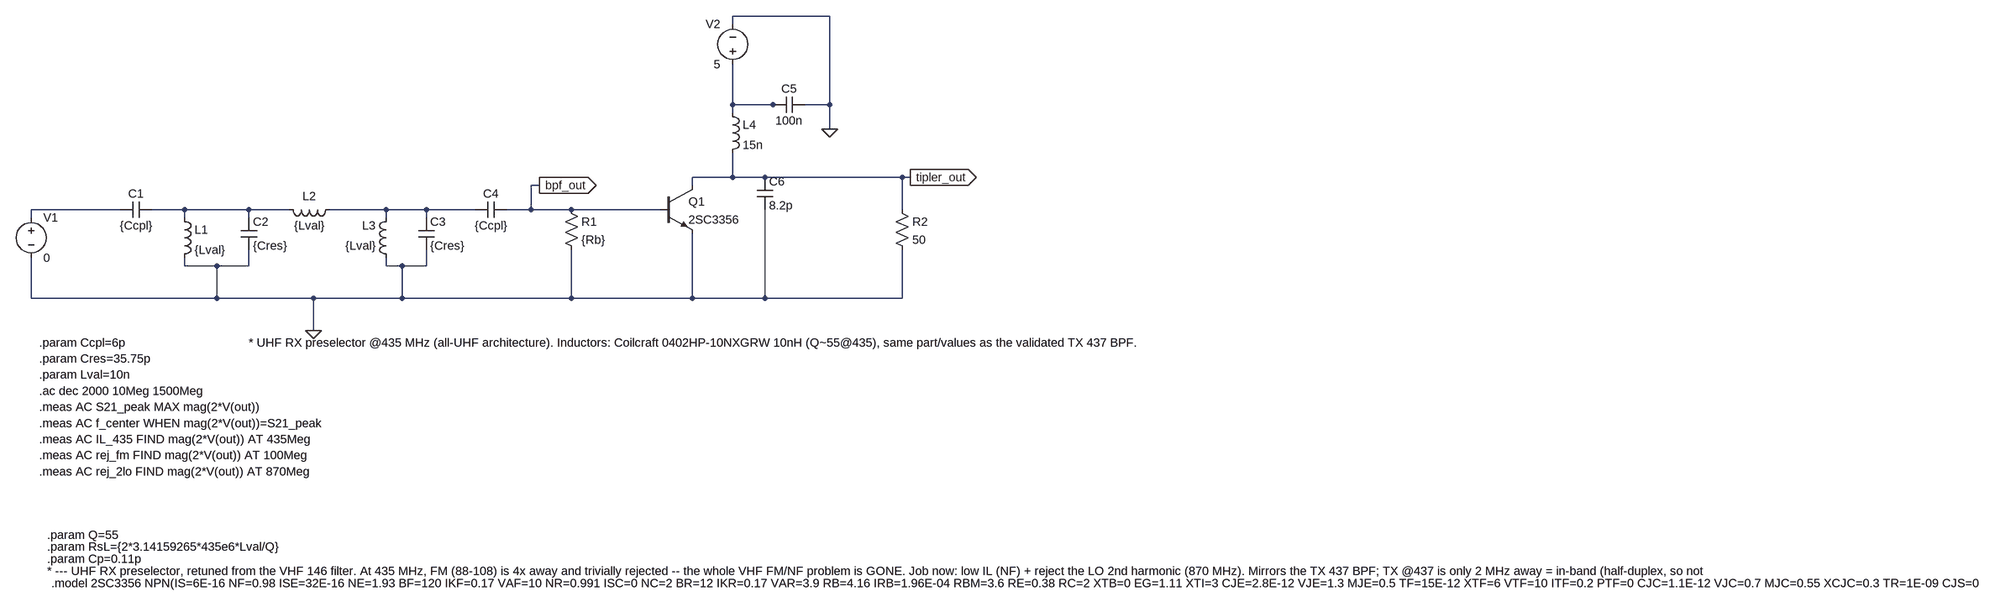
[diagram p0: schematic rx_circuit.asc]
rx_circuit.asc, the LTspice schematic file:
Version 4.1
SHEET 1 4300 1040
WIRE 1472 -256 1280 -256
WIRE 1280 -240 1280 -256
WIRE 1280 -80 1280 -160
WIRE 1360 -80 1280 -80
WIRE 1376 -80 1360 -80
WIRE 1472 -80 1472 -256
WIRE 1472 -80 1424 -80
WIRE 1280 -64 1280 -80
WIRE 1472 -32 1472 -80
WIRE 1280 64 1280 16
WIRE 1280 64 1200 64
WIRE 1344 64 1280 64
WIRE 1616 64 1344 64
WIRE 1632 64 1616 64
WIRE 896 80 880 80
WIRE 1200 80 1200 64
WIRE 64 128 -112 128
WIRE 192 128 128 128
WIRE 320 128 192 128
WIRE 400 128 320 128
WIRE 592 128 480 128
WIRE 672 128 592 128
WIRE 768 128 672 128
WIRE 880 128 880 80
WIRE 880 128 832 128
WIRE 960 128 880 128
WIRE 1136 128 960 128
WIRE 1616 128 1616 64
WIRE -112 144 -112 128
WIRE 192 144 192 128
WIRE 320 144 320 128
WIRE 592 144 592 128
WIRE 672 144 672 128
WIRE 192 240 192 224
WIRE 256 240 192 240
WIRE 320 240 320 208
WIRE 320 240 256 240
WIRE 592 240 592 224
WIRE 624 240 592 240
WIRE 672 240 672 208
WIRE 672 240 624 240
WIRE -112 304 -112 224
WIRE 256 304 256 240
WIRE 256 304 -112 304
WIRE 448 304 256 304
WIRE 624 304 624 240
WIRE 624 304 448 304
WIRE 960 304 960 208
WIRE 960 304 624 304
WIRE 1200 304 1200 176
WIRE 1200 304 960 304
WIRE 1344 304 1344 128
WIRE 1344 304 1200 304
WIRE 1616 304 1616 208
WIRE 1616 304 1344 304
WIRE 448 368 448 304
FLAG 448 368 0
FLAG 1472 -32 0
FLAG 896 80 bpf_out
IOPIN 896 80 Out
FLAG 1632 64 tipler_out
IOPIN 1632 64 Out
SYMBOL cap 128 112 R90
WINDOW 0 0 32 VBottom 2
WINDOW 3 32 32 VTop 2
SYMATTR InstName C1
SYMATTR Value {Ccpl}
SYMBOL ind 176 128 R0
SYMATTR InstName L1
SYMATTR Value {Lval}
SYMATTR SpiceLine Rser={RsL} Cpar={Cp}
SYMBOL cap 304 144 R0
SYMATTR InstName C2
SYMATTR Value {Cres}
SYMBOL ind 496 112 R90
WINDOW 0 5 56 VBottom 2
WINDOW 3 32 56 VTop 2
SYMATTR InstName L2
SYMATTR Value {Lval}
SYMATTR SpiceLine Rser={RsL} Cpar={Cp}
SYMBOL ind 608 240 R180
WINDOW 0 36 80 Left 2
WINDOW 3 36 40 Left 2
SYMATTR InstName L3
SYMATTR Value {Lval}
SYMATTR SpiceLine Rser={RsL} Cpar={Cp}
SYMBOL cap 656 144 R0
SYMATTR InstName C3
SYMATTR Value {Cres}
SYMBOL cap 832 112 R90
WINDOW 0 0 32 VBottom 2
WINDOW 3 32 32 VTop 2
SYMATTR InstName C4
SYMATTR Value {Ccpl}
SYMBOL res 944 112 R0
SYMATTR InstName R1
SYMATTR Value {Rb}
SYMBOL voltage -112 128 R0
SYMATTR InstName V1
SYMATTR Value 0
SYMATTR Value2 AC 1
SYMATTR SpiceLine Rser=50
SYMBOL npn 1136 80 R0
SYMATTR InstName Q1
SYMATTR Value 2SC3356
SYMBOL ind 1264 -80 R0
SYMATTR InstName L4
SYMATTR Value 15n
SYMATTR SpiceLine Rser=1m
SYMBOL cap 1424 -96 R90
WINDOW 0 0 32 VBottom 2
WINDOW 3 32 32 VTop 2
SYMATTR InstName C5
SYMATTR Value 100n
SYMBOL voltage 1280 -144 R180
WINDOW 0 24 96 Left 2
WINDOW 3 24 16 Left 2
WINDOW 123 0 0 Left 0
WINDOW 39 0 0 Left 0
SYMATTR InstName V2
SYMATTR Value 5
SYMBOL cap 1328 64 R0
SYMATTR InstName C6
SYMATTR Value 8.2p
SYMBOL res 1600 112 R0
SYMATTR InstName R2
SYMATTR Value 50
TEXT -96 392 Left 2 !.param Ccpl=6p
TEXT -96 424 Left 2 !.param Cres=35.75p
TEXT -96 456 Left 2 !.param Lval=10n
TEXT 320 392 Left 2 !* UHF RX preselector @435 MHz (all-UHF architecture). Inductors: Coilcraft 0402HP-10NXGRW 10nH (Q~55@435), same part/values as the validated TX 437 BPF.
TEXT -80 792 Left 2 !.param Q=55
TEXT -80 816 Left 2 !.param RsL={2*3.14159265*435e6*Lval/Q}
TEXT -80 840 Left 2 !.param Cp=0.11p
TEXT -80 864 Left 2 !* --- UHF RX preselector, retuned from the VHF 146 filter. At 435 MHz, FM (88-108) is 4x away and trivially rejected -- the whole VHF FM/NF problem is GONE. Job now: low IL (NF) + reject the LO 2nd harmonic (870 MHz). Mirrors the TX 437 BPF; TX @437 is only 2 MHz away = in-band (half-duplex, so not rejected here). ---
TEXT -96 488 Left 2 !.ac dec 2000 10Meg 1500Meg
TEXT -96 520 Left 2 !.meas AC S21_peak MAX mag(2*V(out))
TEXT -96 552 Left 2 !.meas AC f_center WHEN mag(2*V(out))=S21_peak
TEXT -96 584 Left 2 !.meas AC IL_435 FIND mag(2*V(out)) AT 435Meg
TEXT -96 616 Left 2 !.meas AC rej_fm FIND mag(2*V(out)) AT 100Meg
TEXT -96 648 Left 2 !.meas AC rej_2lo FIND mag(2*V(out)) AT 870Meg
TEXT -72 888 Left 2 !.model 2SC3356 NPN(IS=6E-16 NF=0.98 ISE=32E-16 NE=1.93 BF=120 IKF=0.17 VAF=10 NR=0.991 ISC=0 NC=2 BR=12 IKR=0.17 VAR=3.9 RB=4.16 IRB=1.96E-04 RBM=3.6 RE=0.38 RC=2 XTB=0 EG=1.11 XTI=3 CJE=2.8E-12 VJE=1.3 MJE=0.5 TF=15E-12 XTF=6 VTF=10 ITF=0.2 PTF=0 CJC=1.1E-12 VJC=0.7 MJC=0.55 XCJC=0.3 TR=1E-09 CJS=0 VJS=0.75 MJS=0 FC=0.5)

The netlist it stands for:
* rx_circuit.asc
C1 N003 N002 {Ccpl}
L1 N003 0 {Lval} Rser={RsL} Cpar={Cp}
C2 N003 0 {Cres}
L2 N004 N003 {Lval} Rser={RsL} Cpar={Cp}
L3 0 N004 {Lval} Rser={RsL} Cpar={Cp}
C3 N004 0 {Cres}
C4 bpf_out N004 {Ccpl}
R1 bpf_out 0 {Rb}
V1 N002 0 0 AC 1 Rser=50
Q1 tipler_out bpf_out 0 0 2SC3356
L4 N001 tipler_out 15n Rser=1m
C5 0 N001 100n
V2 N001 0 5
C6 tipler_out 0 8.2p
R2 tipler_out 0 50
.model NPN NPN
.model PNP PNP
.lib standard.bjt
.param Ccpl=6p
.param Cres=35.75p
.param Lval=10n
* UHF RX preselector @435 MHz (all-UHF architecture). Inductors: Coilcraft 0402HP-10NXGRW 10nH (Q~55@435), same part/values as the validated TX 437 BPF.
.param Q=55
.param RsL={2*3.14159265*435e6*Lval/Q}
.param Cp=0.11p
* --- UHF RX preselector, retuned from the VHF 146 filter. At 435 MHz, FM (88-108) is 4x away and trivially rejected -- the whole VHF FM/NF problem is GONE. Job now: low IL (NF) + reject the LO 2nd harmonic (870 MHz). Mirrors the TX 437 BPF; TX @437 is only 2 MHz away = in-band (half-duplex, so not rejected here). ---
.ac dec 2000 10Meg 1500Meg
.meas AC S21_peak MAX mag(2*V(out))
.meas AC f_center WHEN mag(2*V(out))=S21_peak
.meas AC IL_435 FIND mag(2*V(out)) AT 435Meg
.meas AC rej_fm FIND mag(2*V(out)) AT 100Meg
.meas AC rej_2lo FIND mag(2*V(out)) AT 870Meg
.model 2SC3356 NPN(IS=6E-16 NF=0.98 ISE=32E-16 NE=1.93 BF=120 IKF=0.17 VAF=10 NR=0.991 ISC=0 NC=2 BR=12 IKR=0.17 VAR=3.9 RB=4.16 IRB=1.96E-04 RBM=3.6 RE=0.38 RC=2 XTB=0 EG=1.11 XTI=3 CJE=2.8E-12 VJE=1.3 MJE=0.5 TF=15E-12 XTF=6 VTF=10 ITF=0.2 PTF=0 CJC=1.1E-12 VJC=0.7 MJC=0.55 XCJC=0.3 TR=1E-09 CJS=0 VJS=0.75 MJS=0 FC=0.5)
.backanno
.end